# EAGLE design BMP085 Breakout-v14 (EAGLE 6.2)
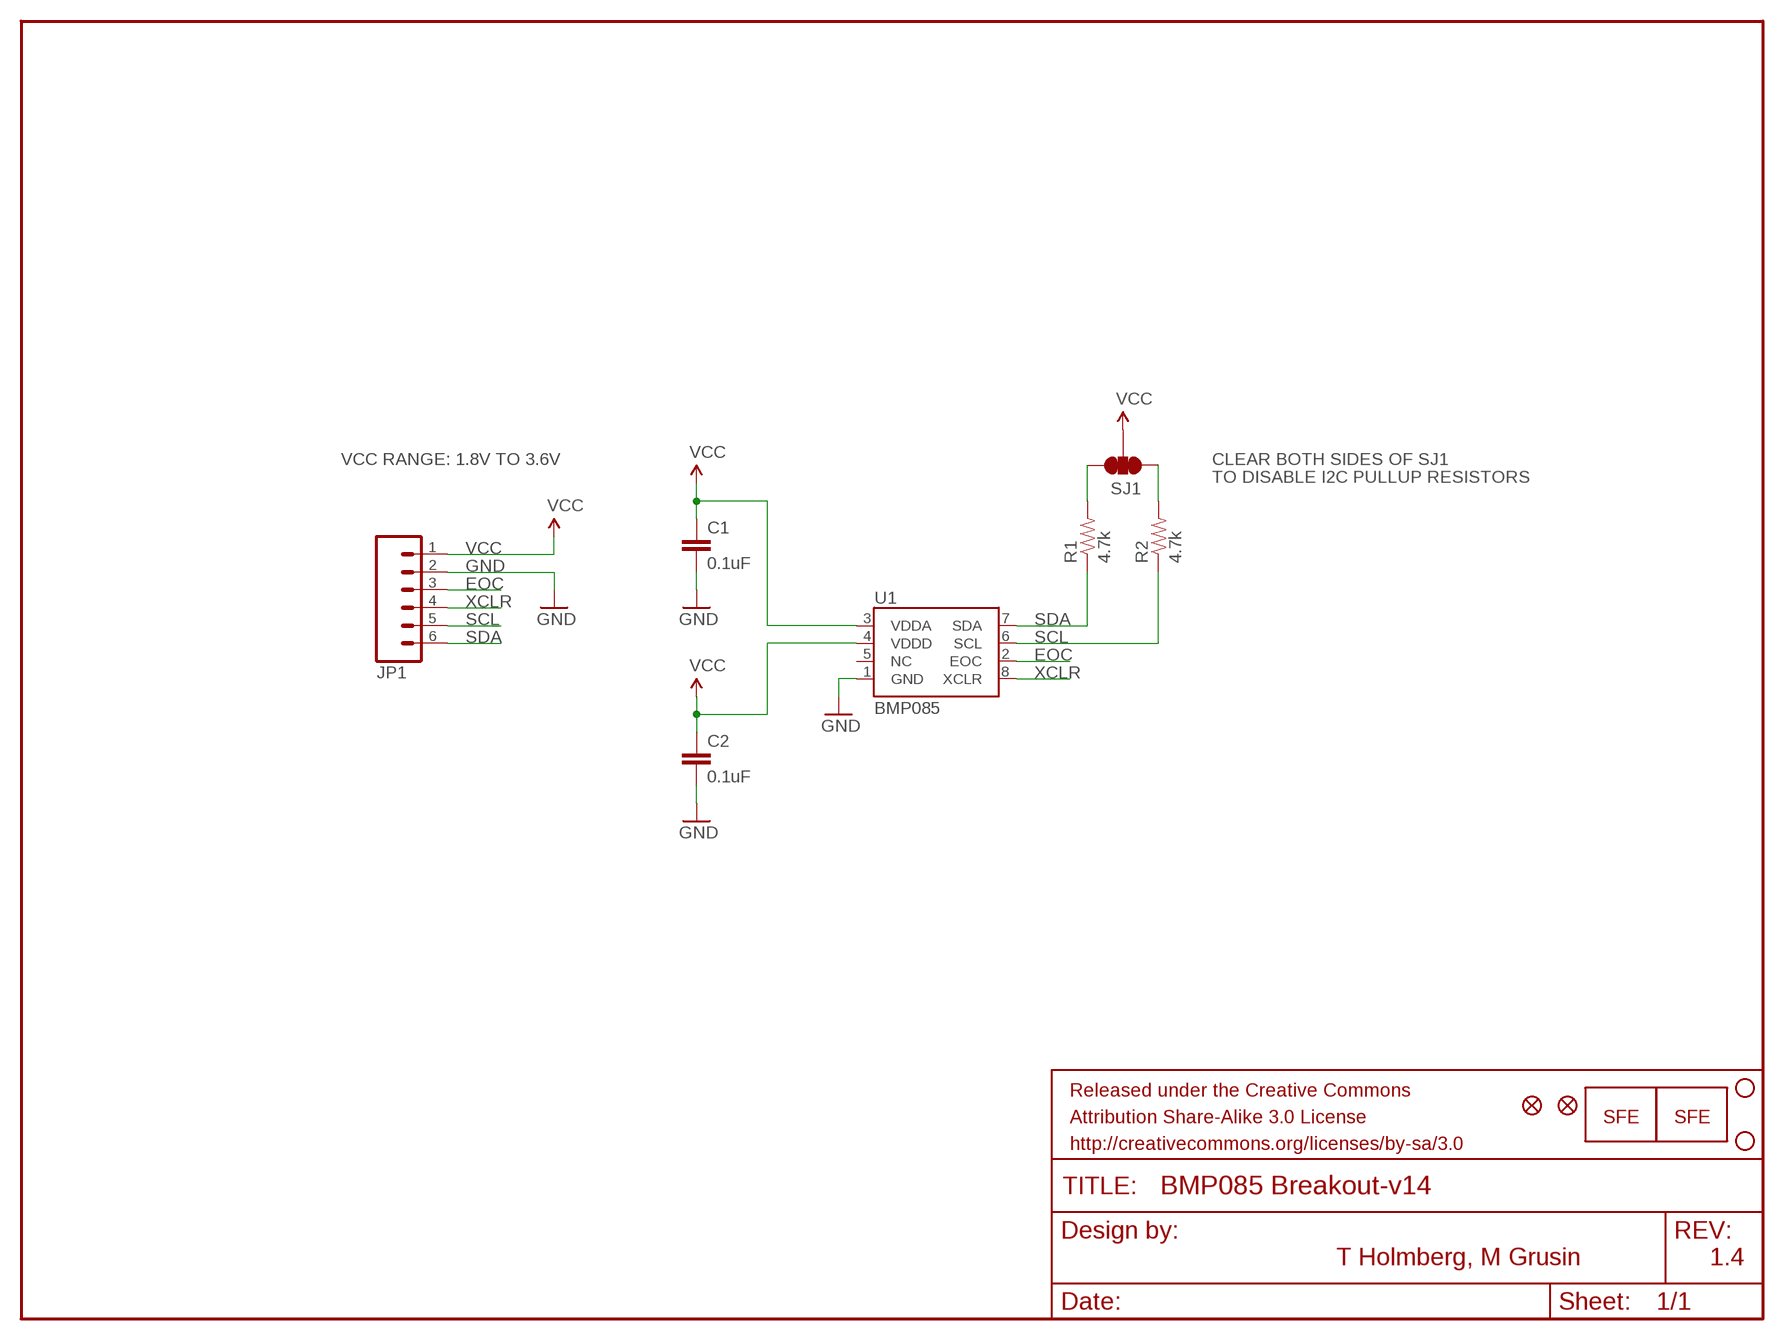
[diagram p0: schematic, sheet 1]

## Parts
C1  0.1uF  CAP0402-CAP  [0402-CAP]
C2  0.1uF  CAP0402-CAP  [0402-CAP]
JP1  M06SIP  [1X06]
JP2  LOGO-SFENW2  [SFE-NEW-WEB]
JP3  FIDUCIALUFIDUCIAL  [MICRO-FIDUCIAL]
JP4  FIDUCIALUFIDUCIAL  [MICRO-FIDUCIAL]
LOGO1  LOGO-SFESK  [SFE-LOGO-FLAME]
R1  4.7k  RESISTOR0402-RES  [0402-RES]
R2  4.7k  RESISTOR0402-RES  [0402-RES]
SJ1  SOLDERJUMPER_2WAYPASTE1&2&3  [SJ_3_PASTE1&2&3]
STANDOFF1  STAND-OFF  [STAND-OFF]
STANDOFF2  STAND-OFF  [STAND-OFF]
U1  BMP085  [BMP085]

## Nets
EOC: JP1.3 U1.2(EOC)
GND: C1.2 C2.2 JP1.2 U1.1(GND)
N$1: R1.2 SJ1.3
N$2: R2.2 SJ1.1
SCL: JP1.5 R2.1 U1.6(SCL)
SDA: JP1.6 R1.1 U1.7(SDA)
VCC: C1.1 C2.1 JP1.1 SJ1.2 U1.3(VDDA) U1.4(VDDD)
XCLR: JP1.4 U1.8(XCLR)
Unconnected: U1.5(NC)

## Notes on the sheet
- VCC RANGE: 1.8V TO 3.6V | CLEAR BOTH SIDES OF SJ1
- TO DISABLE I2C PULLUP RESISTORS
- T Holmberg, M Grusin | 1.4

## Library data of the parts
C1 C2 = SparkFun:CAP: Capacitor Standard 0603 ceramic capacitor, and 0.1" leaded capacitor.
JP1 = SparkFun:M06: Header 6 Standard 6-pin 0.1" header. Use with straight break away headers (SKU : PRT-00116), right angle break away headers (PRT-00553), swiss pins (PRT-00743), machine pins (PRT-00117), and female headers (PRT-00115). Molex polarized connector foot print use with SKU : PRT-08094 with associated crimp pins and housings. NOTES ON THE VARIANTS LOCK and LOCK_LONGPADS... This footprint was designed to help hold the alignment of a through-hole component (i.e. 6-pin header) while soldering it into place. You may notice that each hole has been shifted either up or down by 0.005 of an inch from it's more standard position (which is a perfectly straight line). This slight alteration caused the pins (the squares in the middle) to touch the edges of the holes. Because they are alternating, it causes a "brace" to hold the component in place. 0.005 has proven to be the perfect amount of "off-center" position when using our standard breakaway headers. Although looks a little odd when you look at the bare footprint, once you have a header in there, the alteration is very hard to notice. Also, if you push a header all the way into place, it is covered up entirely on the bottom side. This idea of altering the position of holes to aid alignment will be further integrated into the Sparkfun Library for other footprints. It can help hold any component with 3 or more connection pins.
JP2 = SparkFun-Aesthetics:LOGO-SFE: Spark Fun Electronics PCB Logo This is the standard Spark Fun Electronics PCB logo.
JP3 JP4 = SparkFun-Aesthetics:FIDUCIAL: Fiducial Alignment Points Various fiducial points for machine vision alignment.
LOGO1 = SparkFun:LOGO-SFE: Spark Fun Electronics PCB Logo This is the standard Spark Fun Electronics PCB logo.
R1 R2 = SparkFun:RESISTOR: Resistor Basic schematic elements and footprints for 0603, 1206, and PTH resistors.
SJ1 = mike-temp:SOLDERJUMPER_2WAY: Solder Jumper 2 way solder jumper
STANDOFF1 STANDOFF2 = SparkFun-Electromechanical:STAND-OFF: #4 Stand Off This is the mechanical footprint for a #4 phillips button head screw. Use the keepout ring to avoid running the screw head into surrounding components. SKU : PRT-00447
U1 = SparkFun:BMP085: BMP085 Pressure Sensor Great little MEMS pressure sensor. SKU: COM-09603

## Board
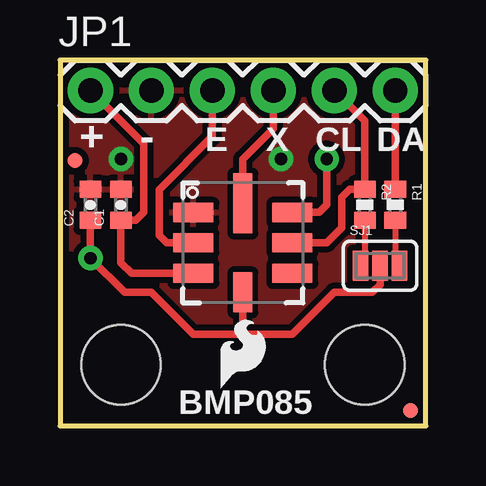
[diagram p1: board, top side]
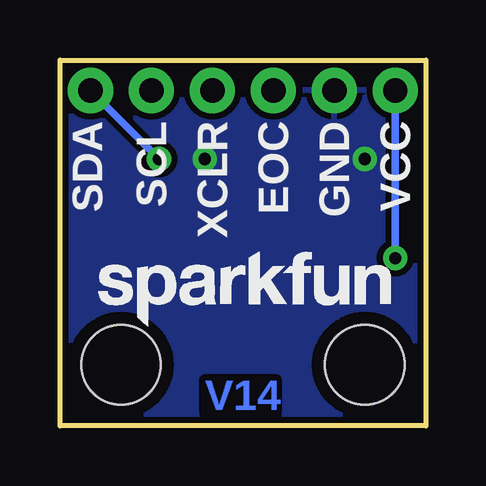
[diagram p2: board, bottom side, seen from below]

Size 15.24 x 15.24 mm. Coordinates in mm from the lower left corner, seen from the top.
Outline: 0,0 15.24,0 15.24,15.24 0,15.24 0,0
Copper layers (1*16): Top 0.035mm / dielectric 1.5mm / Bottom 0.035mm
Design rules: minimum track width 8mil, minimum drill 20mil, track to track 8mil, track to pad 8mil, pad to pad 8mil, via to via 8mil, smd to smd 8mil, copper to edge 8mil, drill to drill 8mil, minimum pad ring 12mil, minimum via ring 10mil, stop-mask expansion 4mil, vias tented up to drill 20mil, thermal gap 10mil

### Footprints (pad centres in the part's own frame; a part is rotated, then mirrored left to right if it is on the bottom)
0402-CAP = smd 0.7 x 0.9: 1 -0.65,0; 2 0.65,0
1X06 = drill 1.016 pad 1.88: 1 0,0; 2 2.54,0; 3 5.08,0; 4 7.62,0; 5 10.16,0; 6 12.7,0
MICRO-FIDUCIAL = smd 0.635 x 0.635: 1 0,0
0402-RES = smd 0.7 x 0.9: 1 -0.65,0; 2 0.65,0
SJ_3_PASTE1&2&3 = smd 0.635 x 1.27: 1 -0.813,0; 2 0,0; 3 0.813,0
STAND-OFF = hole 3.302: 0,0
BMP085 = smd 1.67 x 0.8: 1 -2.065,1.27; 2 -2.065,0; 3 -2.065,-1.27; 5 2.065,-1.27; 6 2.065,0; 7 2.065,1.27 | smd 0.8 x 1.67: 4 0,-2.065 | smd 0.8 x 2.5: 8 0,1.65

### Placement (x,y rotation side)
C1  2.54,9.21 90 top
C2  1.27,9.21 90 top
JP1  1.27,13.97 0 top
JP2  13.65,4.13 0 bottom
JP3  0.64,11.05 0 top
JP4  14.61,0.64 0 top
LOGO1  6.7,1.59 0 top
R1  13.97,9.21 270 top
R2  12.7,9.21 270 top
SJ1  13.34,6.67 0 top
STANDOFF1  12.7,2.54 0 top
STANDOFF2  2.54,2.54 0 top
U1  7.62,7.62 0 top

### Tracks (layer width: path | path; a pad name or v marks a point on that pad's centre or on a via)
EOC
  Top 0.305: U1.2 4.45,7.62 4.13,7.94 4.13,9.84 6.35,12.06 JP1.3
GND  (via drill 0.51)
  other vias: 2.54,11.11 9.21,11.11
  pour Top (isolate 0.254): 0,15.24 0,0 15.24,0 15.24,15.24
  pour Bottom (isolate 0.254): 0,15.24 0,0 15.24,0 15.24,15.24
N$1
  Top 0.254: R1.2 13.97,6.35 SJ1.3
N$2
  Top 0.254: R2.2 12.7,6.35 SJ1.1
SCL
  Top 0.305: JP1.5 12.7,12.7 R2.1 12.08,9.86 11.75,9.53 11.75,8.26 11.11,7.62 U1.6
SDA  (via drill 0.51)
  Top 0.305: R1.1 JP1.6 | U1.7 10.79,8.89 11.11,9.21 v11.11,11.11
  Bottom 0.305: v11.11,11.11 JP1.6
VCC  (via drill 0.51)
  Top 0.305: U1.3 2.99,6.35 2.54,6.8 C1.1 3.16,8.56 3.49,8.89 3.49,11.75 JP1.1 | C2.1 v1.27,6.99 2.7,5.56 3.81,5.56 5.56,3.81 7.62,3.81 | 7.62,3.81 U1.4 | SJ1.2 13.34,5.87 13.02,5.56 11.43,5.56 9.68,3.81 7.62,3.81
  Bottom 0.305: JP1.1 v1.27,6.99
XCLR
  Top 0.305: U1.8 7.62,11.11 8.89,12.38 JP1.4

### Text on the board
Bottom: V14
tPlace: + | - | E | X | CL | DA | BMP085
bPlace: VCC | GND | EOC | XCLR | SCL | SDA
Document: 0.00" | 0.05" | 0.10" | 0.50" | 0.60" | 0.60" | 0.55" | 0.10" | 0.125" DIA X 2 | 0.00"